# Altium project DAQ_v1.PrjPcb
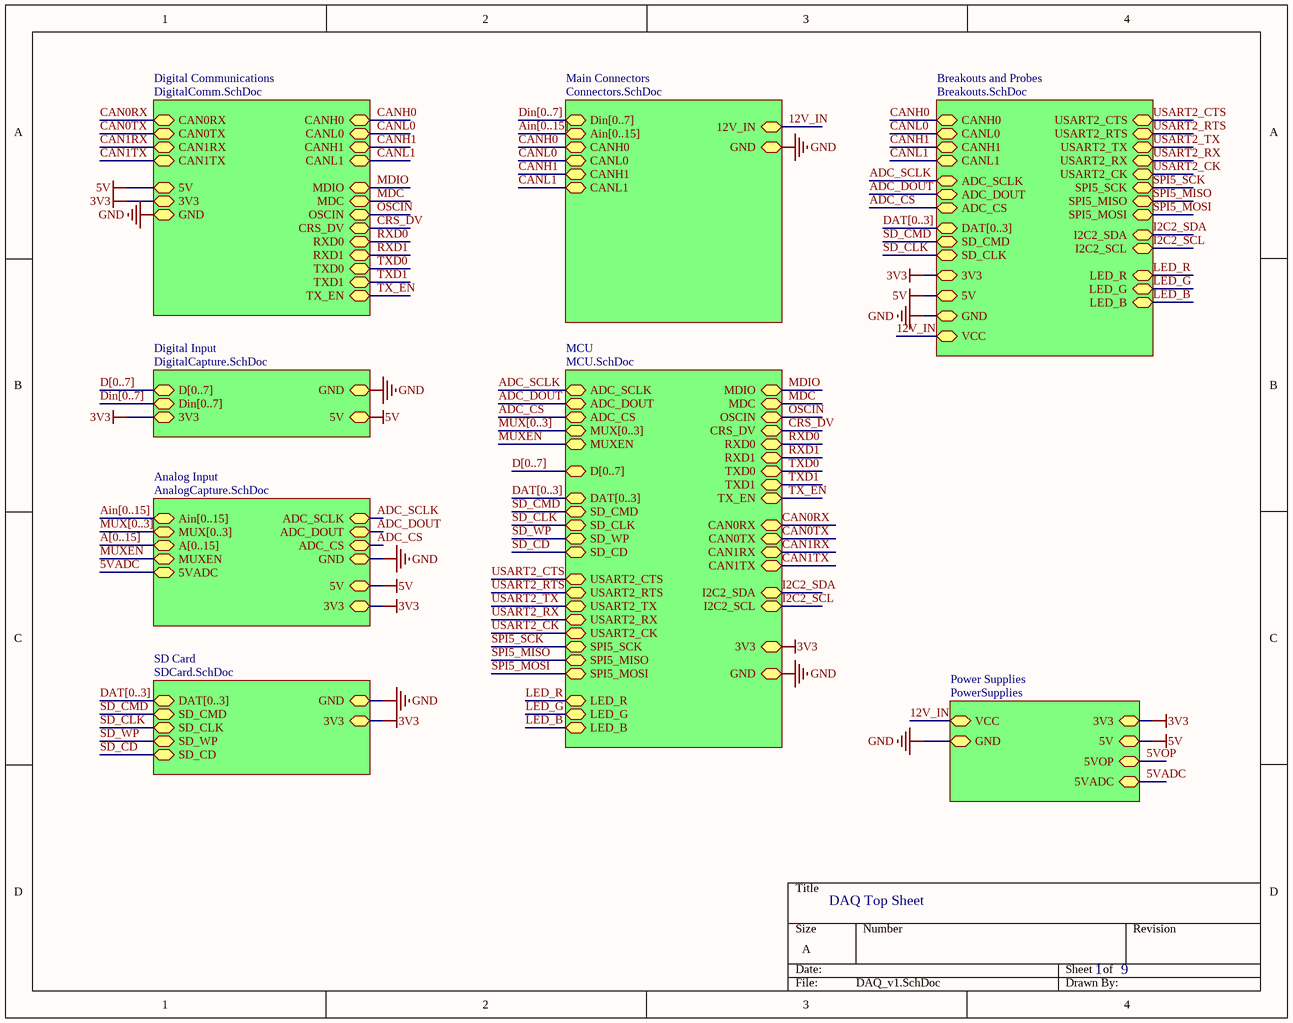
[diagram p0: DAQ_v1.SchDoc]
9 sheets, 174 parts. Net scope: hierarchical (ports join the sheet entries above them; power ports are global).
Board file: DAQ_v1.PcbDoc
Sheets:
  DAQ_v1.SchDoc
    Power Supplies = PowerSupplies.SchDoc
    Analog Input = AnalogCapture.SchDoc
    Digital Communications = DigitalComm.SchDoc
    Digital Input = DigitalCapture.SchDoc
    Main Connectors = Connectors.SchDoc
    MCU = MCU.SchDoc
    SD Card = SDCard.SchDoc
    Breakouts and Probes = Breakouts.SchDoc

## Sheet DAQ_v1.SchDoc: DAQ Top Sheet
size A; DocumentNumber: 1; SheetNumber: 1; SheetTotal: 9

### Sub-sheets
Analog Input = AnalogCapture.SchDoc: Ain[0..15], MUX[0..3], MUXEN, 5VADC, 5V, 3V3, ADC_SCLK, ADC_DOUT, ADC_CS, GND, A[0..15]
Breakouts and Probes = Breakouts.SchDoc: CANH0, CANL0, CANH1, CANL1, ADC_SCLK, ADC_DOUT, ADC_CS, DAT[0..3], SD_CMD, SD_CLK, USART2_CTS, USART2_RTS, USART2_TX, USART2_RX, USART2_CK, SPI5_SCK, SPI5_MISO, SPI5_MOSI, I2C2_SDA, I2C2_SCL, LED_R, LED_G, LED_B, 3V3, 5V, GND, VCC
Digital Communications = DigitalComm.SchDoc: 5V, 3V3, GND, CAN1TX, CAN1RX, CAN0TX, CAN0RX, CANH0, CANL0, CANH1, CANL1, MDIO, MDC, OSCIN, CRS_DV, RXD0, RXD1, TXD0, TXD1, TX_EN
Digital Input = DigitalCapture.SchDoc: D[0..7], Din[0..7], 3V3, GND, 5V
Main Connectors = Connectors.SchDoc: Din[0..7], Ain[0..15], CANH0, CANL0, CANH1, CANL1, 12V_IN, GND
MCU = MCU.SchDoc: MDIO, MDC, OSCIN, CRS_DV, RXD0, RXD1, TXD0, TXD1, TX_EN, ADC_SCLK, ADC_DOUT, ADC_CS, D[0..7], 3V3, GND, CAN1TX, CAN1RX, CAN0TX, CAN0RX, DAT[0..3], SD_CMD, SD_CLK, SD_WP, SD_CD, MUX[0..3], MUXEN, USART2_CTS, USART2_RTS, USART2_TX, USART2_RX, USART2_CK, SPI5_SCK, SPI5_MISO, SPI5_MOSI, I2C2_SDA, I2C2_SCL, LED_R, LED_G, LED_B
Power Supplies = PowerSupplies: 3V3, 5V, 5VOP, 5VADC, VCC, GND
SD Card = SDCard.SchDoc: 3V3, GND, DAT[0..3], SD_CMD, SD_CLK, SD_WP, SD_CD

### Nets
3V3: sheet Power Supplies/3V3, sheet Analog Input/3V3, sheet Digital Communications/3V3, sheet Digital Input/3V3, sheet MCU/3V3, sheet SD Card/3V3, sheet Breakouts and Probes/3V3
5V: sheet Power Supplies/5V, sheet Power Supplies/5VOP, sheet Analog Input/5V, sheet Digital Communications/5V, sheet Digital Input/5V, sheet Breakouts and Probes/5V  [also labelled 5VOP]
5VADC: sheet Power Supplies/5VADC, sheet Analog Input/5VADC
12V_IN: sheet Power Supplies/VCC, sheet Main Connectors/12V_IN, sheet Breakouts and Probes/VCC  [project net 12V]
GND: sheet Power Supplies/GND, sheet Analog Input/GND, sheet Digital Communications/GND, sheet Digital Input/GND, sheet Main Connectors/GND, sheet MCU/GND, sheet SD Card/GND, sheet Breakouts and Probes/GND
ADC_CS: sheet Analog Input/ADC_CS, sheet MCU/ADC_CS, sheet Breakouts and Probes/ADC_CS
ADC_DOUT: sheet Analog Input/ADC_DOUT, sheet MCU/ADC_DOUT, sheet Breakouts and Probes/ADC_DOUT
ADC_SCLK: sheet Analog Input/ADC_SCLK, sheet MCU/ADC_SCLK, sheet Breakouts and Probes/ADC_SCLK
CAN0RX: sheet Digital Communications/CAN0RX, sheet MCU/CAN0RX
CAN0TX: sheet Digital Communications/CAN0TX, sheet MCU/CAN0TX
CAN1RX: sheet Digital Communications/CAN1RX, sheet MCU/CAN1RX
CAN1TX: sheet Digital Communications/CAN1TX, sheet MCU/CAN1TX
CANH0: sheet Digital Communications/CANH0, sheet Main Connectors/CANH0, sheet Breakouts and Probes/CANH0
CANH1: sheet Digital Communications/CANH1, sheet Main Connectors/CANH1, sheet Breakouts and Probes/CANH1
CANL0: sheet Digital Communications/CANL0, sheet Main Connectors/CANL0, sheet Breakouts and Probes/CANL0
CANL1: sheet Digital Communications/CANL1, sheet Main Connectors/CANL1, sheet Breakouts and Probes/CANL1
CRS_DV: sheet Digital Communications/CRS_DV, sheet MCU/CRS_DV
I2C2_SCL: sheet MCU/I2C2_SCL, sheet Breakouts and Probes/I2C2_SCL
I2C2_SDA: sheet MCU/I2C2_SDA, sheet Breakouts and Probes/I2C2_SDA
LED_B: sheet MCU/LED_B, sheet Breakouts and Probes/LED_B
LED_G: sheet MCU/LED_G, sheet Breakouts and Probes/LED_G
LED_R: sheet MCU/LED_R, sheet Breakouts and Probes/LED_R
MDC: sheet Digital Communications/MDC, sheet MCU/MDC
MDIO: sheet Digital Communications/MDIO, sheet MCU/MDIO
MUXEN: sheet Analog Input/MUXEN, sheet MCU/MUXEN
OSCIN: sheet Digital Communications/OSCIN, sheet MCU/OSCIN
RXD0: sheet Digital Communications/RXD0, sheet MCU/RXD0
RXD1: sheet Digital Communications/RXD1, sheet MCU/RXD1
SD_CD: sheet MCU/SD_CD, sheet SD Card/SD_CD
SD_CLK: sheet MCU/SD_CLK, sheet SD Card/SD_CLK, sheet Breakouts and Probes/SD_CLK
SD_CMD: sheet MCU/SD_CMD, sheet SD Card/SD_CMD, sheet Breakouts and Probes/SD_CMD
SD_WP: sheet MCU/SD_WP, sheet SD Card/SD_WP
SPI5_MISO: sheet MCU/SPI5_MISO, sheet Breakouts and Probes/SPI5_MISO
SPI5_MOSI: sheet MCU/SPI5_MOSI, sheet Breakouts and Probes/SPI5_MOSI
SPI5_SCK: sheet MCU/SPI5_SCK, sheet Breakouts and Probes/SPI5_SCK
TX_EN: sheet Digital Communications/TX_EN, sheet MCU/TX_EN
TXD0: sheet Digital Communications/TXD0, sheet MCU/TXD0
TXD1: sheet Digital Communications/TXD1, sheet MCU/TXD1
USART2_CK: sheet MCU/USART2_CK, sheet Breakouts and Probes/USART2_CK
USART2_CTS: sheet MCU/USART2_CTS, sheet Breakouts and Probes/USART2_CTS
USART2_RTS: sheet MCU/USART2_RTS, sheet Breakouts and Probes/USART2_RTS
USART2_RX: sheet MCU/USART2_RX, sheet Breakouts and Probes/USART2_RX
USART2_TX: sheet MCU/USART2_TX, sheet Breakouts and Probes/USART2_TX

### Buses and harness runs
bus A[0..15] = sheet Analog Input/A[0..15]
bus Ain[0..15] = sheet Analog Input/Ain[0..15]
bus Ain[0..15] = sheet Main Connectors/Ain[0..15]
bus D[0..7] = sheet Digital Input/D[0..7]
bus D[0..7] = sheet MCU/D[0..7]
bus DAT[0..3] = sheet Breakouts and Probes/DAT[0..3]
bus DAT[0..3] = sheet MCU/DAT[0..3]
bus DAT[0..3] = sheet SD Card/DAT[0..3]
bus Din[0..7] = sheet Digital Input/Din[0..7]
bus Din[0..7] = sheet Main Connectors/Din[0..7]
bus MUX[0..3] = sheet Analog Input/MUX[0..3]
bus MUX[0..3] = sheet MCU/MUX[0..3]

## Sheet PowerSupplies.SchDoc: Power Supplies
size A; DocumentNumber: 2; SheetNumber: 2; SheetTotal: 9
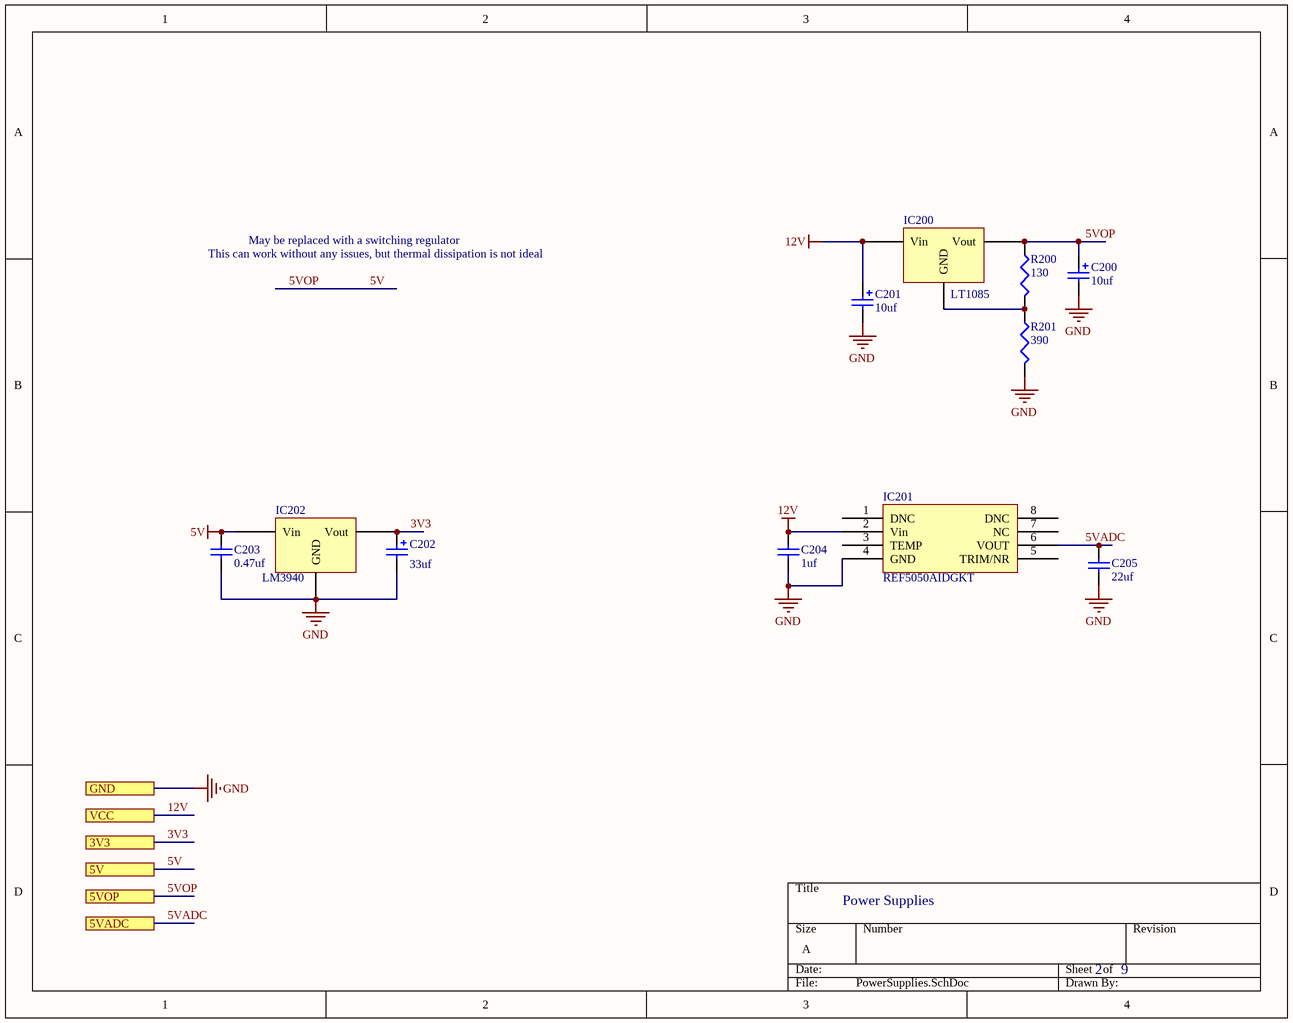
[diagram p1: PowerSupplies.SchDoc]

### Parts
C200  value 10uf  [SMD1206 Polarized]  (hidden comment: Cap)
C201  value 10uf  [SMD1206 Polarized]  (hidden comment: Cap)
C202  value 33uf  [SMD1206 Polarized]  (hidden comment: Cap)
C203  value 0.47uf  [SMD0603]  (hidden comment: Cap)
C204  value 1uf  [SMD0603]  (hidden comment: Capacitor Ceramic)
C205  value 22uf  [SMD1206]  (hidden comment: Capacitor Ceramic)
IC200  LT1085  [DPAK - 3pin]
IC201  REF5050AIDGKT  [VSSOP-8 (DGK)]
IC202  LM3940  [SOT-223]
R200  value 130  [SMD0603]  (hidden comment: Res)
R201  value 390  [SMD0603]  (hidden comment: Res)

### Ports
3V3, 5V, 5VADC, 5VOP, GND, VCC

### Nets
3V3: C202.1 IC202.Vout ; port 3V3
5V: C200.1 C203.2 IC200.Vout IC202.Vin R200.1 ; port 5V, port 5VOP  [also labelled 5VOP]
5VADC: C205.2 IC201.6(VOUT) ; port 5VADC
12V: C201.1 C204.2 IC200.Vin IC201.2(Vin) ; port VCC
GND: C200.2 C201.2 C202.2 C203.1 C204.1 C205.1 IC201.4(GND) IC202.GND R201.2 ; port GND
NetIC200_GND: IC200.GND R200.2 R201.1

Not connected (* = marked no-connect by the designer): IC201 1(DNC) 3(TEMP) 5(TRIM/NR) 7(NC) 8(DNC)

### Notes on the sheet
- This can work without any issues, but thermal dissipation is not ideal
- May be replaced with a switching regulator

### Library data of the parts
C200-C202 = Capacitor Polarized: Polarized Capacitor (Surface Mount)
C203-C205 = Capacitor Ceramic: Ceramic Chip Capacitor
IC200 = LT1085: 3A DC/DC Converter (SM); pin to pad: GND>1 Vin>3 Vout>2
IC201 = REF5050AIDGKT: 5V Precision Reference Voltage
IC202 = LM3940: 3.3V 1A LDO; pin to pad: GND>2 Vin>1 Vout>3
R200 R201 = Resistor

## Sheet AnalogCapture.SchDoc: Analog Capture
size A; DocumentNumber: 3; SheetNumber: 3; SheetTotal: 9
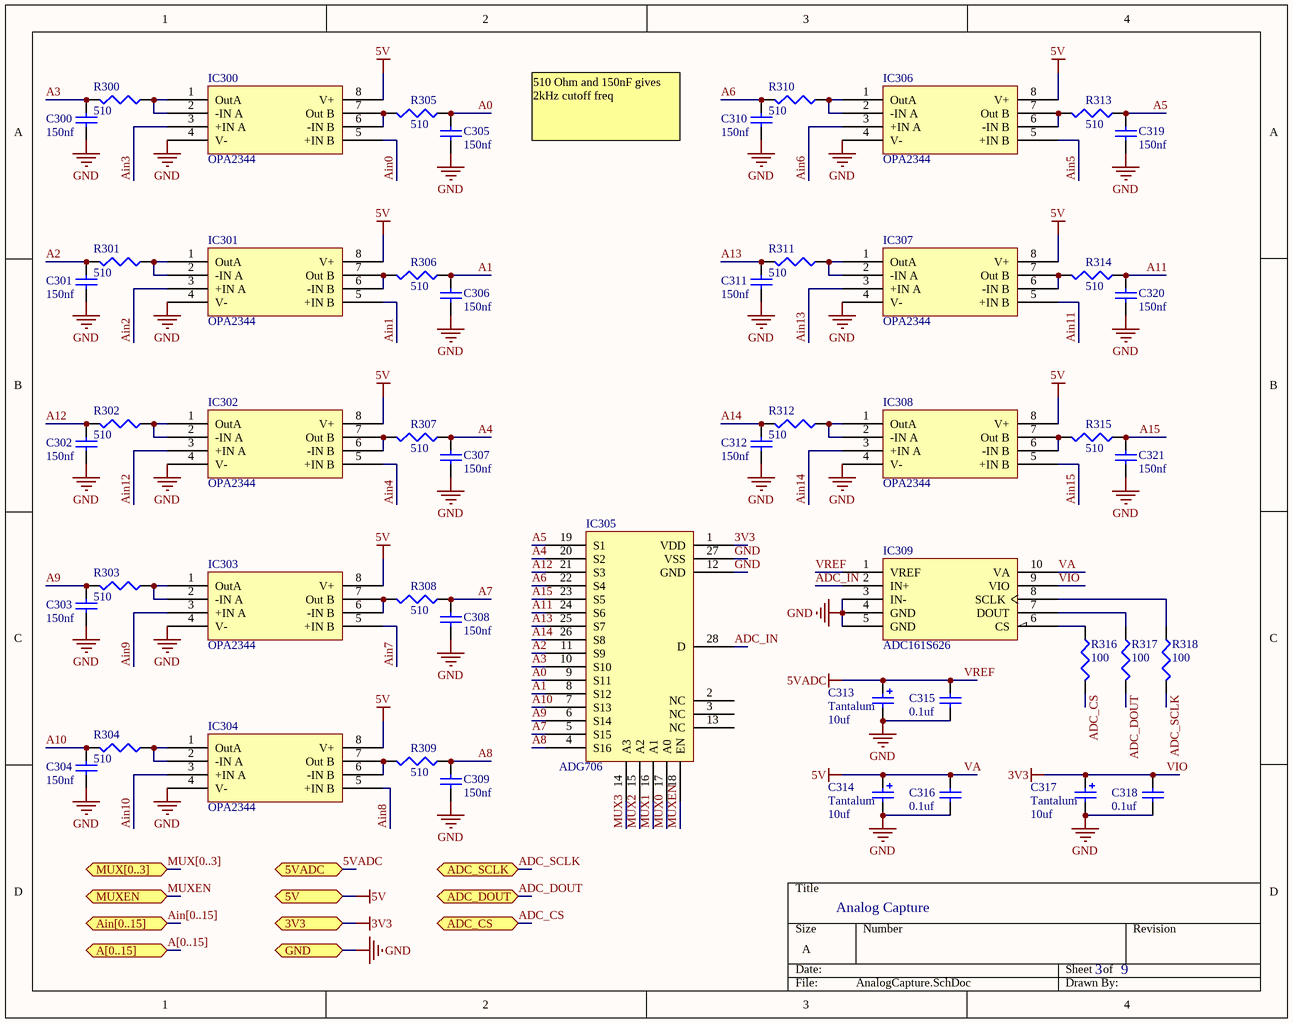
[diagram p2: AnalogCapture.SchDoc]

### Parts
C300  value 150nf  [SMD0603]  (hidden comment: Cap)
C301  value 150nf  [SMD0603]  (hidden comment: Cap)
C302  value 150nf  [SMD0603]  (hidden comment: Cap)
C303  value 150nf  [SMD0603]  (hidden comment: Cap)
C304  value 150nf  [SMD0603]  (hidden comment: Cap)
C305  value 150nf  [SMD0603]  (hidden comment: Cap)
C306  value 150nf  [SMD0603]  (hidden comment: Cap)
C307  value 150nf  [SMD0603]  (hidden comment: Cap)
C308  value 150nf  [SMD0603]  (hidden comment: Cap)
C309  value 150nf  [SMD0603]  (hidden comment: Cap)
C310  value 150nf  [SMD0603]  (hidden comment: Cap)
C311  value 150nf  [SMD0603]  (hidden comment: Cap)
C312  value 150nf  [SMD0603]  (hidden comment: Cap)
C313  Tantalum  value 10uf  [SMD1206 Polarized]
C314  Tantalum  value 10uf  [SMD1206 Polarized]
C315  value 0.1uf  [SMD0603]  (hidden comment: Capacitor Ceramic)
C316  value 0.1uf  [SMD0603]  (hidden comment: Capacitor Ceramic)
C317  Tantalum  value 10uf  [SMD1206 Polarized]
C318  value 0.1uf  [SMD0603]  (hidden comment: Capacitor Ceramic)
C319  value 150nf  [SMD0603]  (hidden comment: Cap)
C320  value 150nf  [SMD0603]  (hidden comment: Cap)
C321  value 150nf  [SMD0603]  (hidden comment: Cap)
IC300  OPA2344  [SOIC-8]
IC301  OPA2344  [SOIC-8]
IC302  OPA2344  [SOIC-8]
IC303  OPA2344  [SOIC-8]
IC304  OPA2344  [SOIC-8]
IC305  ADG706  [TSSOP-28]
IC306  OPA2344  [SOIC-8]
IC307  OPA2344  [SOIC-8]
IC308  OPA2344  [SOIC-8]
IC309  ADC161S626  [VSSOP-10 (DGS)]
R300  value 510  [SMD0603]  (hidden comment: Res)
R301  value 510  [SMD0603]  (hidden comment: Res)
R302  value 510  [SMD0603]  (hidden comment: Res)
R303  value 510  [SMD0603]  (hidden comment: Res)
R304  value 510  [SMD0603]  (hidden comment: Res)
R305  value 510  [SMD0603]  (hidden comment: Res)
R306  value 510  [SMD0603]  (hidden comment: Res)
R307  value 510  [SMD0603]  (hidden comment: Res)
R308  value 510  [SMD0603]  (hidden comment: Res)
R309  value 510  [SMD0603]  (hidden comment: Res)
R310  value 510  [SMD0603]  (hidden comment: Res)
R311  value 510  [SMD0603]  (hidden comment: Res)
R312  value 510  [SMD0603]  (hidden comment: Res)
R313  value 510  [SMD0603]  (hidden comment: Res)
R314  value 510  [SMD0603]  (hidden comment: Res)
R315  value 510  [SMD0603]  (hidden comment: Res)
R316  value 100  [SMD0603]  (hidden comment: Res)
R317  value 100  [SMD0603]  (hidden comment: Res)
R318  value 100  [SMD0603]  (hidden comment: Res)

### Ports
3V3, 5V, 5VADC, A[0..15], ADC_CS, ADC_DOUT, ADC_SCLK, Ain[0..15], GND, MUX[0..3], MUXEN

### Nets
3V3: C317.1 C318.2 IC305.1(VDD) IC309.9(VIO) ; port 3V3  [also labelled VIO]
5V: C314.1 C316.2 IC300.8(V+) IC301.8(V+) IC302.8(V+) IC303.8(V+) IC304.8(V+) IC306.8(V+) IC307.8(V+) IC308.8(V+) IC309.10(VA) ; port 5V  [also labelled VA]
5VADC: C313.1 C315.2 IC309.1(VREF) ; port 5VADC  [also labelled VREF]
GND: C300.2 C301.2 C302.2 C303.2 C304.2 C305.1 C306.1 C307.1 C308.1 C309.1 C310.2 C311.2 C312.2 C313.2 C314.2 C315.1 C316.1 C317.2 C318.1 C319.1 C320.1 C321.1 IC300.4(V-) IC301.4(V-) IC302.4(V-) IC303.4(V-) IC304.4(V-) IC305.12(GND) IC305.27(VSS) IC306.4(V-) IC307.4(V-) IC308.4(V-) IC309.3(IN-) IC309.4(GND) IC309.5(GND) ; port GND
A0: C305.2 IC305.9(S11) R305.1
A1: C306.2 IC305.8(S12) R306.1
A2: C301.1 IC305.11(S9) R301.2
A3: C300.1 IC305.10(S10) R300.2
A4: C307.2 IC305.20(S2) R307.1
A5: C319.2 IC305.19(S1) R313.1
A6: C310.1 IC305.22(S4) R310.2
A7: C308.2 IC305.5(S15) R308.1
A8: C309.2 IC305.4(S16) R309.1
A9: C303.1 IC305.6(S14) R303.2
A10: C304.1 IC305.7(S13) R304.2
A11: C320.2 IC305.24(S6) R314.1
A12: C302.1 IC305.21(S3) R302.2
A13: C311.1 IC305.25(S7) R311.2
A14: C312.1 IC305.26(S8) R312.2
A15: C321.2 IC305.23(S5) R315.1
ADC_CS: R316.2 ; port ADC_CS
ADC_DOUT: R317.2 ; port ADC_DOUT
ADC_IN: IC305.28(D) IC309.2(IN+)
ADC_SCLK: R318.2 ; port ADC_SCLK
Ain0: IC300.5(+IN_B)
Ain1: IC301.5(+IN_B)
Ain2: IC301.3(+IN_A)
Ain3: IC300.3(+IN_A)
Ain4: IC302.5(+IN_B)
Ain5: IC306.5(+IN_B)
Ain6: IC306.3(+IN_A)
Ain7: IC303.5(+IN_B)
Ain8: IC304.5(+IN_B)
Ain9: IC303.3(+IN_A)
Ain10: IC304.3(+IN_A)
Ain11: IC307.5(+IN_B)
Ain12: IC302.3(+IN_A)
Ain13: IC307.3(+IN_A)
Ain14: IC308.3(+IN_A)
Ain15: IC308.5(+IN_B)
MUX0: IC305.17(A0)
MUX1: IC305.16(A1)
MUX2: IC305.15(A2)
MUX3: IC305.14(A3)
MUXEN: IC305.18(EN) ; port MUXEN
NetIC300_1: IC300.1(OutA) IC300.2(-IN_A) R300.1
NetIC300_6: IC300.6(-IN_B) IC300.7(Out_B) R305.2
NetIC301_1: IC301.1(OutA) IC301.2(-IN_A) R301.1
NetIC301_6: IC301.6(-IN_B) IC301.7(Out_B) R306.2
NetIC302_1: IC302.1(OutA) IC302.2(-IN_A) R302.1
NetIC302_6: IC302.6(-IN_B) IC302.7(Out_B) R307.2
NetIC303_1: IC303.1(OutA) IC303.2(-IN_A) R303.1
NetIC303_6: IC303.6(-IN_B) IC303.7(Out_B) R308.2
NetIC304_1: IC304.1(OutA) IC304.2(-IN_A) R304.1
NetIC304_6: IC304.6(-IN_B) IC304.7(Out_B) R309.2
NetIC306_1: IC306.1(OutA) IC306.2(-IN_A) R310.1
NetIC306_6: IC306.6(-IN_B) IC306.7(Out_B) R313.2
NetIC307_1: IC307.1(OutA) IC307.2(-IN_A) R311.1
NetIC307_6: IC307.6(-IN_B) IC307.7(Out_B) R314.2
NetIC308_1: IC308.1(OutA) IC308.2(-IN_A) R312.1
NetIC308_6: IC308.6(-IN_B) IC308.7(Out_B) R315.2
NetIC309_6: IC309.6(CS) R316.1
NetIC309_7: IC309.7(DOUT) R317.1
NetIC309_8: IC309.8(SCLK) R318.1

Not connected (* = marked no-connect by the designer): IC305 2(NC) 3(NC) 13(NC)

### Buses and harness runs
bus A[0..15] = port A[0..15]
bus Ain[0..15] = port Ain[0..15]
bus MUX[0..3] = port MUX[0..3]

### Notes on the sheet
- 510 Ohm and 150nF gives 2kHz cutoff freq

### Library data of the parts
C300-C312 C315 C316 C318-C321 = Capacitor Ceramic: Ceramic Chip Capacitor
C313 C314 C317 = Capacitor Polarized: Polarized Capacitor (Surface Mount)
IC300-IC304 IC306-IC308 = OPA2344: Rail to rail opamp
IC305 = ADG706: 16:1 Mux
IC309 = ADC161S626: TI ADC; 250ksps
R300-R318 = Resistor

## Sheet DigitalComm.SchDoc: Digital Communications
size A; DocumentNumber: 4; SheetNumber: 4; SheetTotal: 9
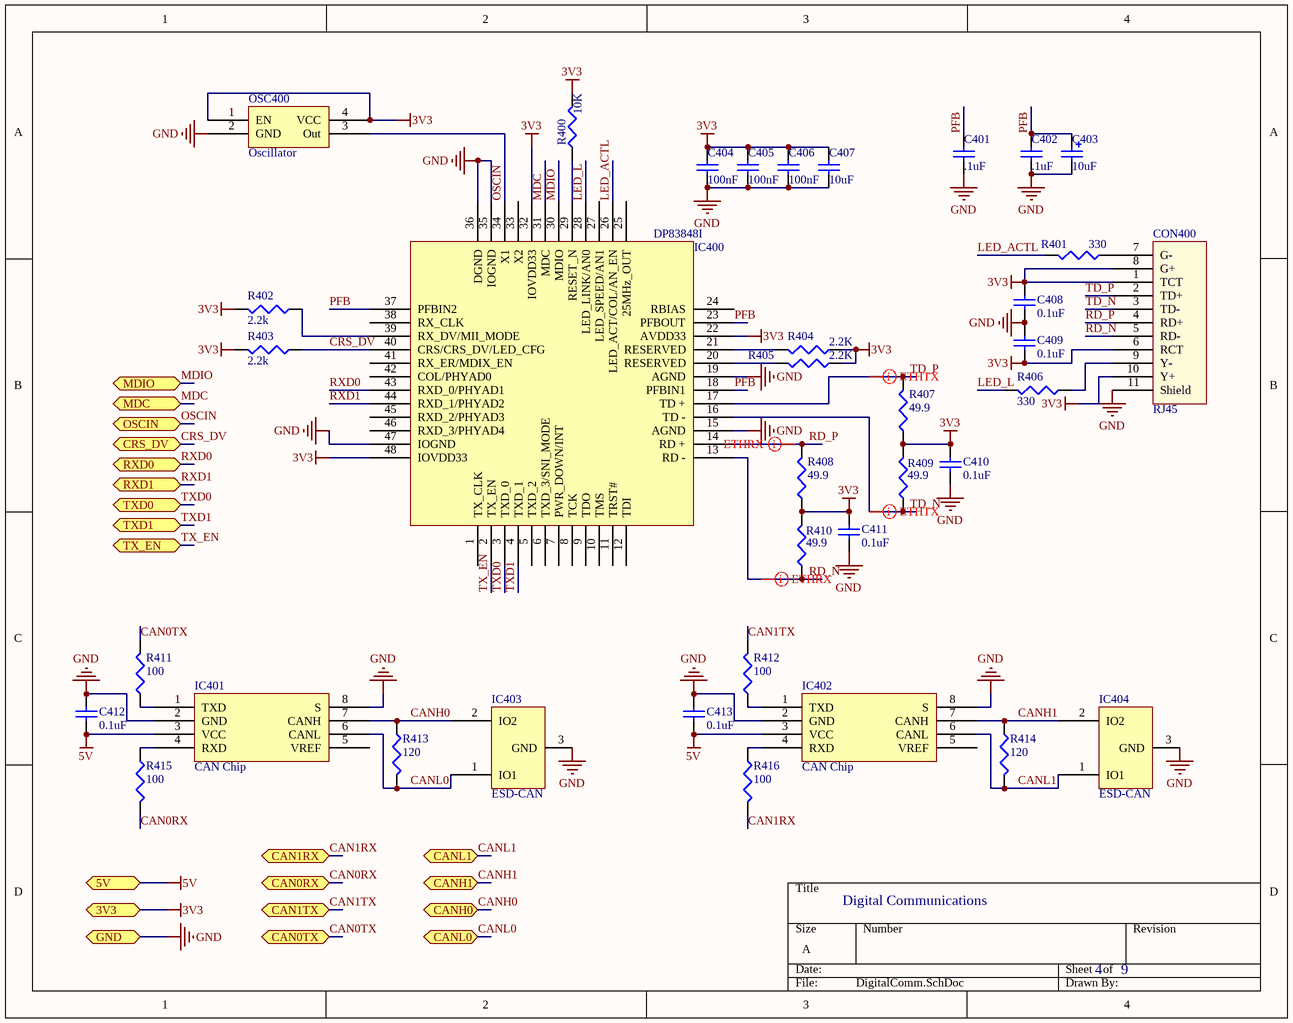
[diagram p3: DigitalComm.SchDoc]

### Parts
C401  value .1uF  [SMD0603]  (hidden comment: Capacitor Ceramic)
C402  value .1uF  [SMD0603]  (hidden comment: Capacitor Ceramic)
C403  value 10uF  [SMD1206 Polarized]  (hidden comment: Cap)
C404  value 100nF  [SMD0603]  (hidden comment: Capacitor Ceramic)
C405  value 100nF  [SMD0603]  (hidden comment: Capacitor Ceramic)
C406  value 100nF  [SMD0603]  (hidden comment: Capacitor Ceramic)
C407  value 10uF  [SMD0805]  (hidden comment: Capacitor Ceramic)
C408  value 0.1uF  [SMD0603]  (hidden comment: Cap)
C409  value 0.1uF  [SMD0603]  (hidden comment: Cap)
C410  value 0.1uF  [SMD0603]  (hidden comment: Cap)
C411  value 0.1uF  [SMD0603]  (hidden comment: Cap)
C412  value 0.1uF  [SMD0603]  (hidden comment: Capacitor Ceramic)
C413  value 0.1uF  [SMD0603]  (hidden comment: Capacitor Ceramic)
CON400  RJ45  [RJ45]
IC400  DP83848I  [LQFP-48]
IC401  CAN Chip  [SOIC-8]
IC402  CAN Chip  [SOIC-8]
IC403  ESD-CAN  [SOT-23-3]
IC404  ESD-CAN  [SOT-23-3]
OSC400  Oscillator  [SM77H-OSC]
R400  value 10K  [SMD0603]  (hidden comment: Res)
R401  value 330  [SMD0603]  (hidden comment: Res)
R402  value 2.2k  [SMD0603]  (hidden comment: Res)
R403  value 2.2k  [SMD0603]  (hidden comment: Res)
R404  value 2.2K  [SMD0603]  (hidden comment: Res)
R405  value 2.2K  [SMD0603]  (hidden comment: Res)
R406  value 330  [SMD0603]  (hidden comment: Res)
R407  value 49.9  [SMD0603]  (hidden comment: Res)
R408  value 49.9  [SMD0603]  (hidden comment: Res)
R409  value 49.9  [SMD0603]  (hidden comment: Res)
R410  value 49.9  [SMD0603]  (hidden comment: Res)
R411  value 100  [SMD0603]  (hidden comment: Res)
R412  value 100  [SMD0603]  (hidden comment: Res)
R413  value 120  [SMD0603]  (hidden comment: Res)
R414  value 120  [SMD0603]  (hidden comment: Res)
R415  value 100  [SMD0603]  (hidden comment: Res)
R416  value 100  [SMD0603]  (hidden comment: Res)

### Ports
3V3, 5V, CAN0RX, CAN0TX, CAN1RX, CAN1TX, CANH0, CANH1, CANL0, CANL1, CRS_DV, GND, MDC, MDIO, OSCIN, RXD0, RXD1, TX_EN, TXD0, TXD1

### Nets
3V3: C404.2 C405.2 C406.2 C407.2 C408.2 C409.1 C410.2 C411.2 CON400.1(TCT) CON400.6(RCT) CON400.8(G+) CON400.10(Y+) IC400.22(AVDD33) IC400.32(IOVDD33) IC400.48(IOVDD33) OSC400.1(EN) OSC400.4(VCC) R400.2 R402.2 R403.2 R404.1 R405.1 R407.1 R408.1 R409.2 R410.2 ; port 3V3
5V: C412.1 C413.1 IC401.3(VCC) IC402.3(VCC) ; port 5V
GND: C401.1 C402.1 C403.2 C404.1 C405.1 C406.1 C407.1 C408.1 C409.2 C410.1 C411.1 C412.2 C413.2 CON400.11(Shield) IC400.15(AGND) IC400.19(AGND) IC400.35(IOGND) IC400.36(DGND) IC400.47(IOGND) IC401.2(GND) IC401.8(S) IC402.2(GND) IC402.8(S) IC403.3(GND) IC404.3(GND) OSC400.2(GND) ; port GND
CAN0RX: R415.2 ; port CAN0RX
CAN0TX: R411.2 ; port CAN0TX
CAN1RX: R416.2 ; port CAN1RX
CAN1TX: R412.2 ; port CAN1TX
CANH0: IC401.7(CANH) IC403.2(IO2) R413.1 ; port CANH0
CANH1: IC402.7(CANH) IC404.2(IO2) R414.1 ; port CANH1
CANL0: IC401.6(CANL) IC403.1(IO1) R413.2 ; port CANL0
CANL1: IC402.6(CANL) IC404.1(IO1) R414.2 ; port CANL1
CRS_DV: IC400.40(CRS/CRS_DV/LED_CFG) R403.1 ; port CRS_DV
LED_ACTL: IC400.26(LED_ACT/COL/AN_EN) R401.2
LED_L: IC400.28(LED_LINK/AN0) R406.2
MDC: IC400.31(MDC) ; port MDC
MDIO: IC400.30(MDIO) ; port MDIO
OSCIN: IC400.34(X1) OSC400.3(Out) ; port OSCIN
PFB: C401.2 C402.2 C403.1 IC400.18(PFBIN1) IC400.23(PFBOUT) IC400.37(PFBIN2)
RD_N: CON400.5(RD-) IC400.13(RD_-) R410.1
RD_P: CON400.4(RD+) IC400.14(RD_+) R408.2
RXD0: IC400.43(RXD_0/PHYAD1) ; port RXD0
RXD1: IC400.44(RXD_1/PHYAD2) ; port RXD1
TD_N: CON400.3(TD-) IC400.16(TD_-) R409.1
TD_P: CON400.2(TD+) IC400.17(TD_+) R407.2
TX_EN: IC400.2(TX_EN) ; port TX_EN
TXD0: IC400.3(TXD_0) ; port TXD0
TXD1: IC400.4(TXD_1) ; port TXD1
NetCON400_7: CON400.7(G-) R401.1
NetCON400_9: CON400.9(Y-) R406.1
NetIC400_20: IC400.20(RESERVED) R405.2
NetIC400_21: IC400.21(RESERVED) R404.2
NetIC400_29: IC400.29(RESET_N) R400.1
NetIC400_39: IC400.39(RX_DV/MII_MODE) R402.1
NetIC401_1: IC401.1(TXD) R411.1
NetIC401_4: IC401.4(RXD) R415.1
NetIC402_1: IC402.1(TXD) R412.1
NetIC402_4: IC402.4(RXD) R416.1

Not connected (* = marked no-connect by the designer): IC400 1(TX_CLK) 5(TXD_2) 6(TXD_3/SNI_MODE) 7(PWR_DOWN/INT) 8(TCK) 9(TDO) 10(TMS) 11(TRST#) 12(TDI) 24(RBIAS) 25(25MHz_OUT) 27(LED_SPEED/AN1) 33(X2) 38(RX_CLK) 41(RX_ER/MDIX_EN) 42(COL/PHYAD0) 45(RXD_2/PHYAD3) 46(RXD_3/PHYAD4); IC401 5(VREF); IC402 5(VREF)

### Layout directives
differential pair: RD_N, RD_P, TD_N, TD_P

### Library data of the parts
C401 C402 C404-C413 = Capacitor Ceramic: Ceramic Chip Capacitor
C403 = Capacitor Polarized: Polarized Capacitor (Surface Mount)
CON400 = RJ45: RJ45 Ethernet Connector with built in magnetics; pin to pad: 11>S
IC400 = DP83848I: Ethernet PHY IC; compatitble with DP83848C
IC401 IC402 = SN65HVD1050
IC403 IC404 = ESDCAN24-2BLY
OSC400 = SM7745HEV: 50Mhz Oscillator
R400-R416 = Resistor

## Sheet DigitalCapture.SchDoc: Digital Capture
size A; DocumentNumber: 5; SheetNumber: 5; SheetTotal: 9
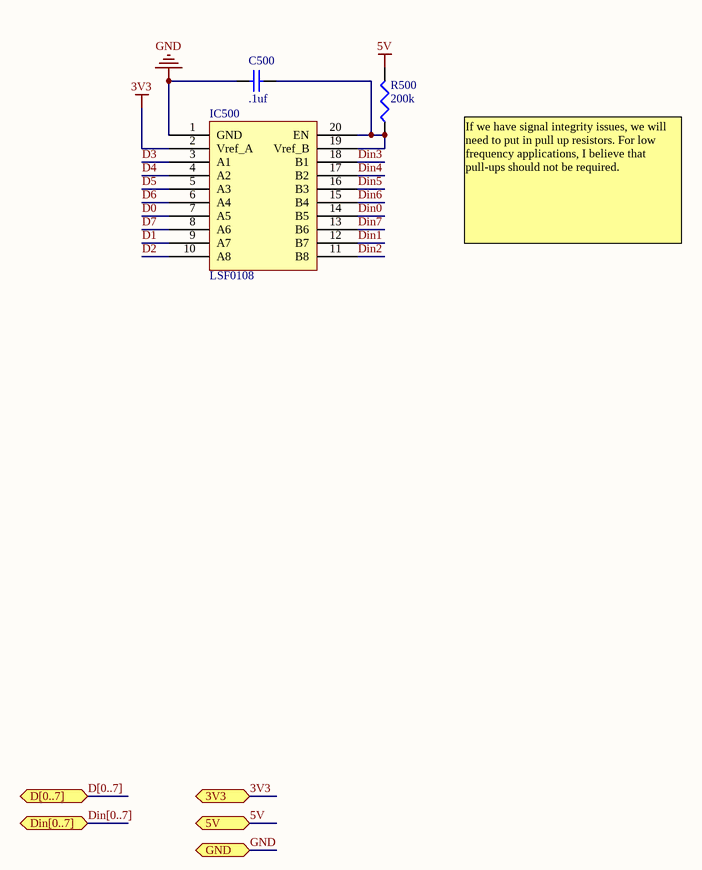
[diagram p4: DigitalCapture.SchDoc]

### Parts
C500  value .1uf  [SMD0603]  (hidden comment: Cap)
IC500  LSF0108  [TSSOP-20]
R500  value 200k  [SMD0603]  (hidden comment: Res)

### Ports
3V3, 5V, D[0..7], Din[0..7], GND

### Nets
3V3: IC500.2(Vref_A) ; port 3V3
5V: R500.2 ; port 5V
GND: C500.2 IC500.1(GND) ; port GND
D0: IC500.7(A5)
D1: IC500.9(A7)
D2: IC500.10(A8)
D3: IC500.3(A1)
D4: IC500.4(A2)
D5: IC500.5(A3)
D6: IC500.6(A4)
D7: IC500.8(A6)
Din0: IC500.14(B5)
Din1: IC500.12(B7)
Din2: IC500.11(B8)
Din3: IC500.18(B1)
Din4: IC500.17(B2)
Din5: IC500.16(B3)
Din6: IC500.15(B4)
Din7: IC500.13(B6)
NetC500_1: C500.1 IC500.19(Vref_B) IC500.20(EN) R500.1

### Buses and harness runs
bus D[0..7] = port D[0..7]
bus Din[0..7] = port Din[0..7]

### Notes on the sheet
- If we have signal integrity issues, we will need to put in pull up resistors. For low frequency applications, I believe that pull-ups should not be required.

### Library data of the parts
C500 = Capacitor Ceramic: Ceramic Chip Capacitor
IC500 = LSF0108: 8 bit 5V to 3.3V level shifter
R500 = Resistor

## Sheet Connectors.SchDoc: Connectors and IO
size A; DocumentNumber: 6; SheetNumber: 6; SheetTotal: 9
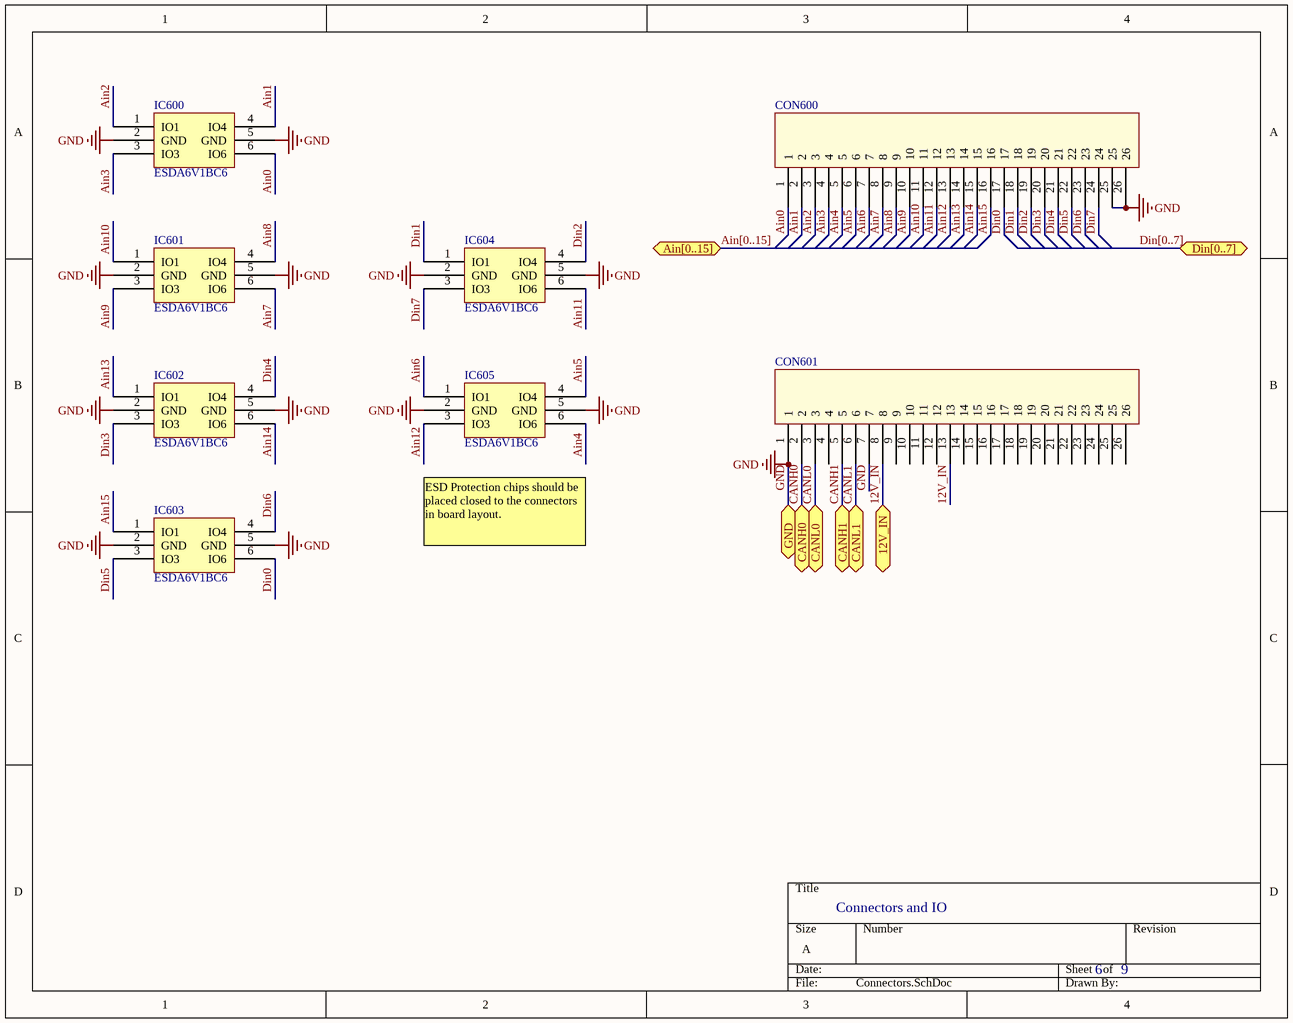
[diagram p5: Connectors.SchDoc]

### Parts
CON600  26 Pin Conn  [AMP SuperSeal 1.0 26pin]  (value not drawn)
CON601  26 Pin Conn  [AMP SuperSeal 1.0 26pin]  (value not drawn)
IC600  ESDA6V1BC6  [SOT23-6L]
IC601  ESDA6V1BC6  [SOT23-6L]
IC602  ESDA6V1BC6  [SOT23-6L]
IC603  ESDA6V1BC6  [SOT23-6L]
IC604  ESDA6V1BC6  [SOT23-6L]
IC605  ESDA6V1BC6  [SOT23-6L]

### Ports
12V_IN, Ain[0..15], CANH0, CANH1, CANL0, CANL1, Din[0..7], GND

### Nets
12V_IN: CON601.8 CON601.13 ; port 12V_IN  [project net 12V]
GND: CON600.25 CON600.26 CON601.1 CON601.7 IC600.2(GND) IC600.5(GND) IC601.2(GND) IC601.5(GND) IC602.2(GND) IC602.5(GND) IC603.2(GND) IC603.5(GND) IC604.2(GND) IC604.5(GND) IC605.2(GND) IC605.5(GND) ; port GND
Ain0: CON600.1 IC600.6(IO6)
Ain1: CON600.2 IC600.4(IO4)
Ain2: CON600.3 IC600.1(IO1)
Ain3: CON600.4 IC600.3(IO3)
Ain4: CON600.5 IC605.6(IO6)
Ain5: CON600.6 IC605.4(IO4)
Ain6: CON600.7 IC605.1(IO1)
Ain7: CON600.8 IC601.6(IO6)
Ain8: CON600.9 IC601.4(IO4)
Ain9: CON600.10 IC601.3(IO3)
Ain10: CON600.11 IC601.1(IO1)
Ain11: CON600.12 IC604.6(IO6)
Ain12: CON600.13 IC605.3(IO3)
Ain13: CON600.14 IC602.1(IO1)
Ain14: CON600.15 IC602.6(IO6)
Ain15: CON600.16 IC603.1(IO1)
CANH0: CON601.2 ; port CANH0
CANH1: CON601.5 ; port CANH1
CANL0: CON601.3 ; port CANL0
CANL1: CON601.6 ; port CANL1
Din0: CON600.17 IC603.6(IO6)
Din1: CON600.18 IC604.1(IO1)
Din2: CON600.19 IC604.4(IO4)
Din3: CON600.20 IC602.3(IO3)
Din4: CON600.21 IC602.4(IO4)
Din5: CON600.22 IC603.3(IO3)
Din6: CON600.23 IC603.4(IO4)
Din7: CON600.24 IC604.3(IO3)

Not connected (* = marked no-connect by the designer): CON601 4 9 10 11 12 14 15 16 17 18 19 20 21 22 23 24 25 26

### Buses and harness runs
bus Ain[0..15] = port Ain[0..15]
bus Din[0..7] = port Din[0..7]

### Notes on the sheet
- ESD Protection chips should be placed closed to the connectors in board layout.

### Library data of the parts
CON600 CON601 = AMP_26Pin: AMP SuperSeal 1.0 26 Pin
IC600-IC605 = ESDA6V1BC6: 4 channel bi directional ESD protection

## Sheet MCU.SchDoc: MCU
size A; DocumentNumber: 9; SheetNumber: 9; SheetTotal: 9
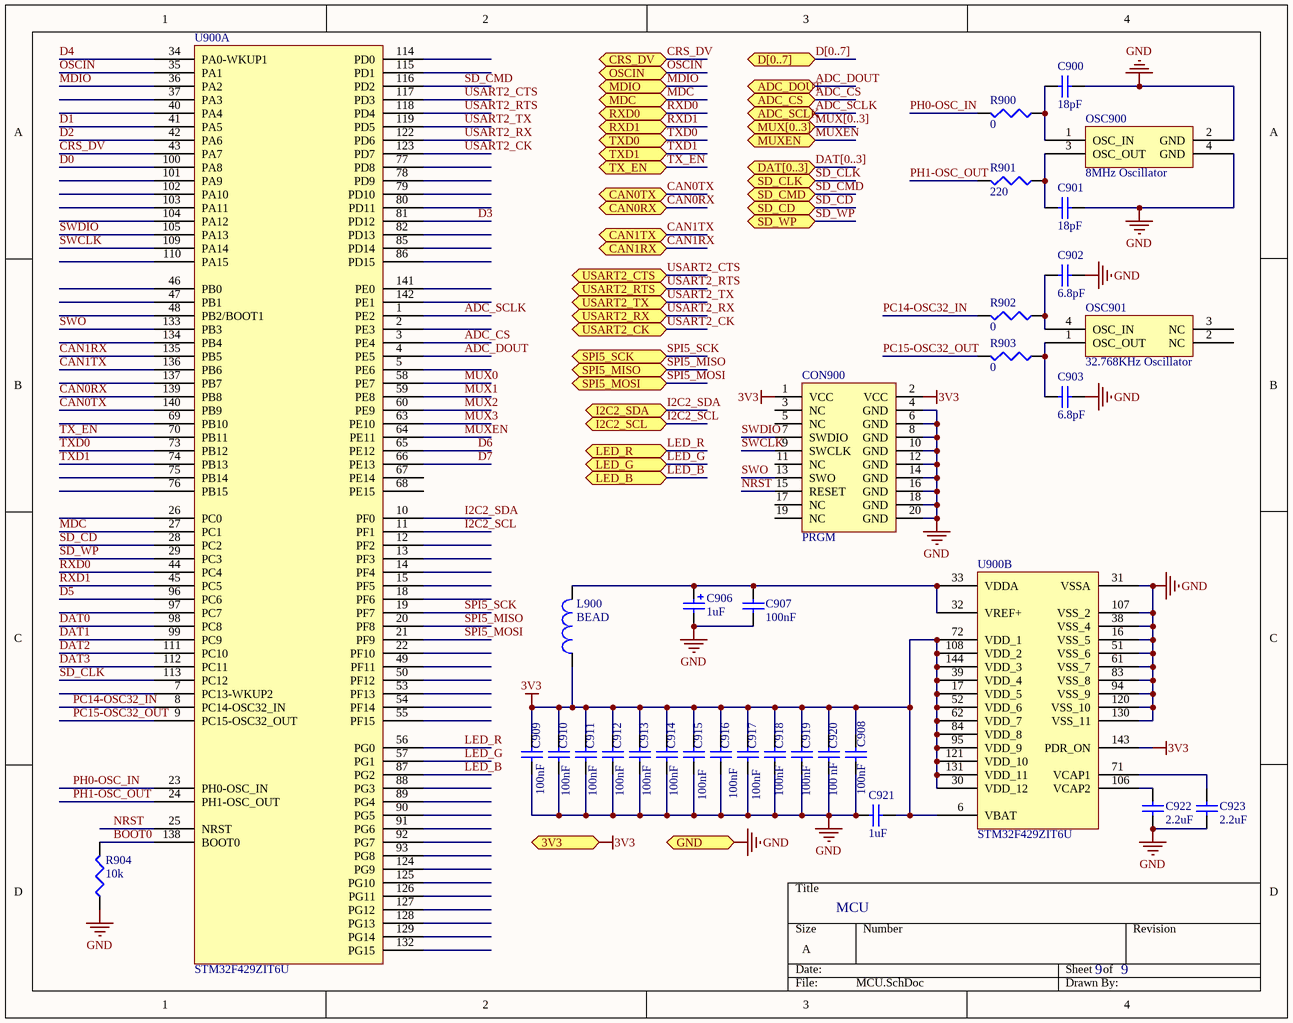
[diagram p6: MCU.SchDoc]

### Parts
C900  value 18pF  [SMD0603]  (hidden comment: Cap)
C901  value 18pF  [SMD0603]  (hidden comment: Cap)
C902  value 6.8pF  [SMD0603]  (hidden comment: Cap)
C903  value 6.8pF  [SMD0603]  (hidden comment: Cap)
C906  value 1uF  [SMD1206 Polarized]  (hidden comment: Cap)
C907  value 100nF  [SMD0603]  (hidden comment: Cap)
C908  value 100nF  [SMD0603]  (hidden comment: Cap)
C909  value 100nF  [SMD0603]  (hidden comment: Cap)
C910  value 100nF  [SMD0603]  (hidden comment: Cap)
C911  value 100nF  [SMD0603]  (hidden comment: Cap)
C912  value 100nF  [SMD0603]  (hidden comment: Cap)
C913  value 100nF  [SMD0603]  (hidden comment: Cap)
C914  value 100nF  [SMD0603]  (hidden comment: Cap)
C915  value 100nF  [SMD0603]  (hidden comment: Cap)
C916  value 100nF  [SMD0603]  (hidden comment: Cap)
C917  value 100nF  [SMD0603]  (hidden comment: Cap)
C918  value 100nF  [SMD0603]  (hidden comment: Cap)
C919  value 100nF  [SMD0603]  (hidden comment: Cap)
C920  value 100 nF  [SMD0603]  (hidden comment: Cap)
C921  value 1uF  [SMD0805]  (hidden comment: Cap)
C922  value 2.2uF  [SMD1206]  (hidden comment: Cap)
C923  value 2.2uF  [SMD1206]  (hidden comment: Cap)
CON900  PRGM  [JTAG/SWO-20PIN]
L900  BEAD  [SMD0603]
OSC900  8MHz Oscillator  [ABMM2-OSC]
OSC901  32.768KHz Oscillator  [MC-306-OSC]
R900  value 0  [SMD0603]  (hidden comment: Res)
R901  value 220  [SMD0603]  (hidden comment: Res)
R902  value 0  [SMD0603]  (hidden comment: Res)
R903  value 0  [SMD0603]  (hidden comment: Res)
R904  value 10k  [SMD0603]  (hidden comment: Res)
U900  STM32F429ZIT6U  [LQPF144]  (parts A,B of 2)

### Ports
3V3, ADC_CS, ADC_DOUT, ADC_SCLK, CAN0RX, CAN0TX, CAN1RX, CAN1TX, CRS_DV, D[0..7], DAT[0..3], GND, I2C2_SCL, I2C2_SDA, LED_B, LED_G, LED_R, MDC, MDIO, MUX[0..3], MUXEN, OSCIN, RXD0, RXD1, SD_CD, SD_CLK, SD_CMD, SD_WP, SPI5_MISO, SPI5_MOSI, SPI5_SCK, TX_EN, TXD0, TXD1, USART2_CK, USART2_CTS, USART2_RTS, USART2_RX, USART2_TX

### Nets
3V3: C908.1 C909.2 C910.2 C911.2 C912.2 C913.2 C914.2 C915.2 C916.2 C917.2 C918.2 C919.2 C920.2 C921.1 CON900.1(VCC) CON900.2(VCC) L900.1 U900.6(VBAT) U900.17(VDD_5) U900.30(VDD_12) U900.39(VDD_4) U900.52(VDD_6) U900.62(VDD_7) U900.72(VDD_1) U900.84(VDD_8) U900.95(VDD_9) U900.108(VDD_2) U900.121(VDD_10) U900.131(VDD_11) U900.143(PDR_ON) U900.144(VDD_3) ; port 3V3
GND: C900.1 C901.1 C902.1 C903.1 C906.2 C907.2 C908.2 C909.1 C910.1 C911.1 C912.1 C913.1 C914.1 C915.1 C916.1 C917.1 C918.1 C919.1 C920.1 C921.2 C922.1 C923.1 CON900.4(GND) CON900.6(GND) CON900.8(GND) CON900.10(GND) CON900.12(GND) CON900.14(GND) CON900.16(GND) CON900.18(GND) CON900.20(GND) OSC900.2(GND) OSC900.4(GND) R904.1 U900.16(VSS_5) U900.31(VSSA) U900.38(VSS_4) U900.51(VSS_6) U900.61(VSS_7) U900.83(VSS_8) U900.94(VSS_9) U900.107(VSS_2) U900.120(VSS_10) U900.130(VSS_11) ; port GND
ADC_CS: U900.3(PE4) ; port ADC_CS
ADC_DOUT: U900.4(PE5) ; port ADC_DOUT
ADC_SCLK: U900.1(PE2) ; port ADC_SCLK
BOOT0: R904.2 U900.138(BOOT0)
CAN0RX: U900.139(PB8) ; port CAN0RX
CAN0TX: U900.140(PB9) ; port CAN0TX
CAN1RX: U900.135(PB5) ; port CAN1RX
CAN1TX: U900.136(PB6) ; port CAN1TX
CRS_DV: U900.43(PA7) ; port CRS_DV
D0: U900.100(PA8)
D1: U900.41(PA5)
D2: U900.42(PA6)
D3: U900.81(PD12)
D4: U900.34(PA0-WKUP1)
D5: U900.96(PC6)
D6: U900.65(PE12)
D7: U900.66(PE13)
DAT0: U900.98(PC8)
DAT1: U900.99(PC9)
DAT2: U900.111(PC10)
DAT3: U900.112(PC11)
I2C2_SCL: U900.11(PF1) ; port I2C2_SCL
I2C2_SDA: U900.10(PF0) ; port I2C2_SDA
LED_B: U900.87(PG2) ; port LED_B
LED_G: U900.57(PG1) ; port LED_G
LED_R: U900.56(PG0) ; port LED_R
MDC: U900.27(PC1) ; port MDC
MDIO: U900.36(PA2) ; port MDIO
MUX0: U900.58(PE7)
MUX1: U900.59(PE8)
MUX2: U900.60(PE9)
MUX3: U900.63(PE10)
MUXEN: U900.64(PE11) ; port MUXEN
NRST: CON900.15(RESET) U900.25(NRST)
OSCIN: U900.35(PA1) ; port OSCIN
PC14-OSC32_IN: R902.2 U900.8(PC14-OSC32_IN)
PC15-OSC32_OUT: R903.2 U900.9(PC15-OSC32_OUT)
PH0-OSC_IN: R900.2 U900.23(PH0-OSC_IN)
PH1-OSC_OUT: R901.2 U900.24(PH1-OSC_OUT)
RXD0: U900.44(PC4) ; port RXD0
RXD1: U900.45(PC5) ; port RXD1
SD_CD: U900.28(PC2) ; port SD_CD
SD_CLK: U900.113(PC12) ; port SD_CLK
SD_CMD: U900.116(PD2) ; port SD_CMD
SD_WP: U900.29(PC3) ; port SD_WP
SPI5_MISO: U900.20(PF8) ; port SPI5_MISO
SPI5_MOSI: U900.21(PF9) ; port SPI5_MOSI
SPI5_SCK: U900.19(PF7) ; port SPI5_SCK
SWCLK: CON900.9(SWCLK) U900.109(PA14)
SWDIO: CON900.7(SWDIO) U900.105(PA13)
SWO: CON900.13(SWO) U900.133(PB3)
TX_EN: U900.70(PB11) ; port TX_EN
TXD0: U900.73(PB12) ; port TXD0
TXD1: U900.74(PB13) ; port TXD1
USART2_CK: U900.123(PD7) ; port USART2_CK
USART2_CTS: U900.117(PD3) ; port USART2_CTS
USART2_RTS: U900.118(PD4) ; port USART2_RTS
USART2_RX: U900.122(PD6) ; port USART2_RX
USART2_TX: U900.119(PD5) ; port USART2_TX
NetC900_2: C900.2 OSC900.1(OSC_IN) R900.1
NetC901_2: C901.2 OSC900.3(OSC_OUT) R901.1
NetC902_2: C902.2 OSC901.4(OSC_IN) R902.1
NetC903_2: C903.2 OSC901.1(OSC_OUT) R903.1
NetC906_1: C906.1 C907.1 L900.2 U900.32(VREF+) U900.33(VDDA)
NetC922_2: C922.2 U900.106(VCAP2)
NetC923_2: C923.2 U900.71(VCAP1)

Not connected (* = marked no-connect by the designer): CON900 3(NC) 5(NC) 11(NC) 17(NC) 19(NC); OSC901 2(NC) 3(NC); U900 2(PE3) 5(PE6) 7(PC13-WKUP2) 12(PF2) 13(PF3) 14(PF4) 15(PF5) 18(PF6) 22(PF10) 26(PC0) 37(PA3) 40(PA4) 46(PB0) 47(PB1) 48(PB2/BOOT1) 49(PF11) 50(PF12) 53(PF13) 54(PF14) 55(PF15) 67(PE14) 68(PE15) 69(PB10) 75(PB14) 76(PB15) 77(PD8) 78(PD9) 79(PD10) 80(PD11) 82(PD13) 85(PD14) 86(PD15) 88(PG3) 89(PG4) 90(PG5) 91(PG6) 92(PG7) 93(PG8) 97(PC7) 101(PA9) 102(PA10) 103(PA11) 104(PA12) 110(PA15) 114(PD0) 115(PD1) 124(PG9) 125(PG10) 126(PG11) 127(PG12) 128(PG13) 129(PG14) 132(PG15) 134(PB4) 137(PB7) 141(PE0) 142(PE1)

### Buses and harness runs
bus D[0..7] = port D[0..7]
bus DAT[0..3] = port DAT[0..3]
bus MUX[0..3] = port MUX[0..3]

### Library data of the parts
C900-C903 C907-C923 = Capacitor Ceramic: Ceramic Chip Capacitor
C906 = Capacitor Polarized: Polarized Capacitor (Surface Mount)
CON900 = JTAG/SWO-20PIN
L900 = Chip Ferrite Bead: Ferrite Bead; Part: BK1608HS601-TV
OSC900 = ABMM2-8.000MHZ-E2-T
OSC901 = MC-306 32.768K-E3: 32.7680kHz Oscillator
R900-R904 = Resistor

## Sheet SDCard.SchDoc: SD Card
size A; DocumentNumber: 7; SheetNumber: 7; SheetTotal: 9
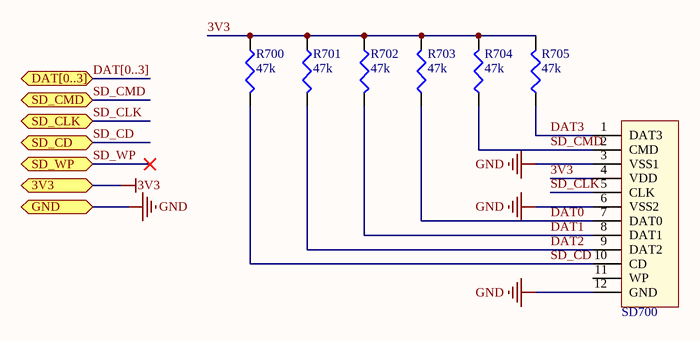
[diagram p7: SDCard.SchDoc]

### Parts
R700  value 47k  [SMD0603]  (hidden comment: Res)
R701  value 47k  [SMD0603]  (hidden comment: Res)
R702  value 47k  [SMD0603]  (hidden comment: Res)
R703  value 47k  [SMD0603]  (hidden comment: Res)
R704  value 47k  [SMD0603]  (hidden comment: Res)
R705  value 47k  [SMD0603]  (hidden comment: Res)
SD700  SD Card Slot  [SDCARD-AMP]  (value not drawn)

### Ports
3V3, DAT[0..3], GND, SD_CD, SD_CLK, SD_CMD, SD_WP

### Nets
3V3: R700.1 R701.1 R702.1 R703.2 R704.2 R705.2 SD700.4(VDD) ; port 3V3
GND: SD700.3(VSS1) SD700.6(VSS2) SD700.12(GND) ; port GND
DAT0: R703.1 SD700.7(DAT0)
DAT1: R702.2 SD700.8(DAT1)
DAT2: R701.2 SD700.9(DAT2)
DAT3: R705.1 SD700.1(DAT3)
SD_CD: R700.2 SD700.10(CD) ; port SD_CD
SD_CLK: SD700.5(CLK) ; port SD_CLK
SD_CMD: R704.1 SD700.2(CMD) ; port SD_CMD

Not connected (* = marked no-connect by the designer): SD700 11(WP)

### Buses and harness runs
bus DAT[0..3] = port DAT[0..3]

### Library data of the parts
R700-R705 = Resistor
SD700 = SD Card Slot: SD Card Connector (Amphenol); pin to pad: 12>GND

## Sheet Breakouts.SchDoc: Breakouts and Testpoints
size A; DocumentNumber: 8; SheetNumber: 8; SheetTotal: 9
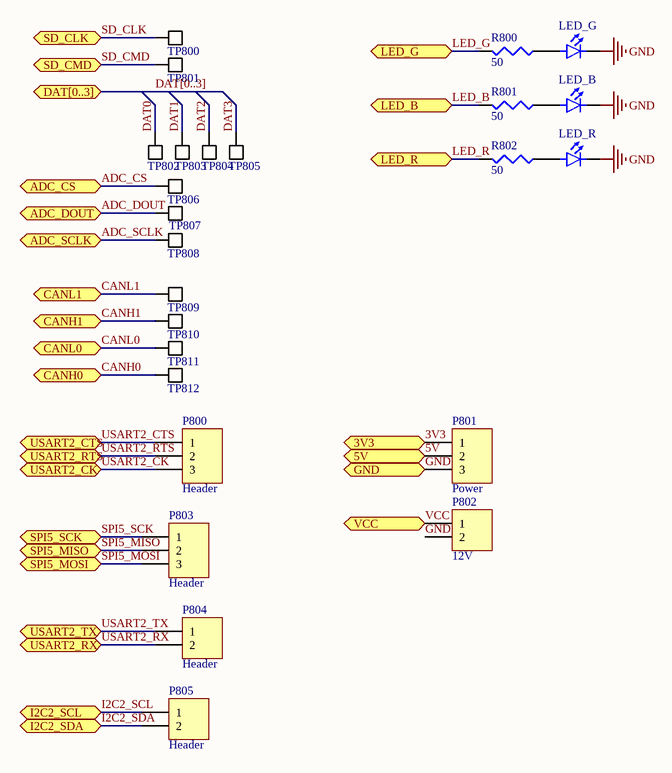
[diagram p8: Breakouts.SchDoc]

### Parts
LED_B  LED  [SMD0603 POLARIZED]  (value not drawn)
LED_G  LED  [SMD0603 POLARIZED]  (value not drawn)
LED_R  LED  [SMD0603 POLARIZED]  (value not drawn)
P800  Header  [HEADER 3X1]
P801  Power  [HEADER 3X1]
P802  12V  [Header 2x1]
P803  Header  [HEADER 3X1]
P804  Header  [Header 2x1]
P805  Header  [Header 2x1]
R800  value 50  [SMD0603]  (hidden comment: Res)
R801  value 50  [SMD0603]  (hidden comment: Res)
R802  value 50  [SMD0603]  (hidden comment: Res)
TP800  Test Point  [Test Point]  (value not drawn)
TP801  Test Point  [Test Point]  (value not drawn)
TP802  Test Point  [Test Point]  (value not drawn)
TP803  Test Point  [Test Point]  (value not drawn)
TP804  Test Point  [Test Point]  (value not drawn)
TP805  Test Point  [Test Point]  (value not drawn)
TP806  Test Point  [Test Point]  (value not drawn)
TP807  Test Point  [Test Point]  (value not drawn)
TP808  Test Point  [Test Point]  (value not drawn)
TP809  Test Point  [Test Point]  (value not drawn)
TP810  Test Point  [Test Point]  (value not drawn)
TP811  Test Point  [Test Point]  (value not drawn)
TP812  Test Point  [Test Point]  (value not drawn)

### Ports
3V3, 5V, ADC_CS, ADC_DOUT, ADC_SCLK, CANH0, CANH1, CANL0, CANL1, DAT[0..3], GND, I2C2_SCL, I2C2_SDA, LED_B, LED_G, LED_R, SD_CLK, SD_CMD, SPI5_MISO, SPI5_MOSI, SPI5_SCK, USART2_CK, USART2_CTS, USART2_RTS, USART2_RX, USART2_TX, VCC

### Nets
3V3: P801.1 ; port 3V3
5V: P801.2 ; port 5V
GND: LED_B.2(Cathode_(-)) LED_G.2(Cathode_(-)) LED_R.2(Cathode_(-)) P801.3 P802.2 ; port GND
VCC: P802.1 ; port VCC  [project net 12V]
ADC_CS: TP806.1 ; port ADC_CS
ADC_DOUT: TP807.1 ; port ADC_DOUT
ADC_SCLK: TP808.1 ; port ADC_SCLK
CANH0: TP812.1 ; port CANH0
CANH1: TP810.1 ; port CANH1
CANL0: TP811.1 ; port CANL0
CANL1: TP809.1 ; port CANL1
DAT0: TP802.1
DAT1: TP803.1
DAT2: TP804.1
DAT3: TP805.1
I2C2_SCL: P805.1 ; port I2C2_SCL
I2C2_SDA: P805.2 ; port I2C2_SDA
LED_B: R801.2 ; port LED_B
LED_G: R800.2 ; port LED_G
LED_R: R802.2 ; port LED_R
SD_CLK: TP800.1 ; port SD_CLK
SD_CMD: TP801.1 ; port SD_CMD
SPI5_MISO: P803.2 ; port SPI5_MISO
SPI5_MOSI: P803.3 ; port SPI5_MOSI
SPI5_SCK: P803.1 ; port SPI5_SCK
USART2_CK: P800.3 ; port USART2_CK
USART2_CTS: P800.1 ; port USART2_CTS
USART2_RTS: P800.2 ; port USART2_RTS
USART2_RX: P804.2 ; port USART2_RX
USART2_TX: P804.1 ; port USART2_TX
NetLED_B_1: LED_B.1(Anode_(+)) R801.1
NetLED_G_1: LED_G.1(Anode_(+)) R800.1
NetLED_R_1: LED_R.1(Anode_(+)) R802.1

### Buses and harness runs
bus DAT[0..3] = port DAT[0..3]

### Library data of the parts
P800 P801 P803 = Header 3x1: Header, 2-Pin
P802 P804 P805 = Header 2x1: Header, 2-Pin
R800-R802 = Resistor
TP800-TP812 = Test Point: Supplier 1: Digi-Key; Supplier Part Number 1: 5019KCT-ND

## Nets that join several sheets
3V3: PowerSupplies (C202.1 IC202.Vout), AnalogCapture (C317.1 C318.2 IC305.1 IC309.9), DigitalComm (26 pins), DigitalCapture (IC500.2), MCU (31 pins), SDCard (7 pins), Breakouts (P801.1)
5V: PowerSupplies (5 pins), AnalogCapture (11 pins), DigitalComm (C412.1 C413.1 IC401.3 IC402.3), DigitalCapture (R500.2), Breakouts (P801.2)
5VADC: PowerSupplies (C205.2 IC201.6), AnalogCapture (C313.1 C315.2 IC309.1)
12V: PowerSupplies (C201.1 C204.2 IC200.Vin IC201.2), Connectors (CON601.8 CON601.13), Breakouts (P802.1)
GND: PowerSupplies (9 pins), AnalogCapture (35 pins), DigitalComm (26 pins), DigitalCapture (C500.2 IC500.1), Connectors (16 pins), MCU (44 pins), SDCard (SD700.3 SD700.6 SD700.12), Breakouts (5 pins)
ADC_CS: AnalogCapture (R316.2), MCU (U900.3), Breakouts (TP806.1)
ADC_DOUT: AnalogCapture (R317.2), MCU (U900.4), Breakouts (TP807.1)
ADC_SCLK: AnalogCapture (R318.2), MCU (U900.1), Breakouts (TP808.1)
Ain0: AnalogCapture (IC300.5), Connectors (CON600.1 IC600.6)
Ain1: AnalogCapture (IC301.5), Connectors (CON600.2 IC600.4)
Ain2: AnalogCapture (IC301.3), Connectors (CON600.3 IC600.1)
Ain3: AnalogCapture (IC300.3), Connectors (CON600.4 IC600.3)
Ain4: AnalogCapture (IC302.5), Connectors (CON600.5 IC605.6)
Ain5: AnalogCapture (IC306.5), Connectors (CON600.6 IC605.4)
Ain6: AnalogCapture (IC306.3), Connectors (CON600.7 IC605.1)
Ain7: AnalogCapture (IC303.5), Connectors (CON600.8 IC601.6)
Ain8: AnalogCapture (IC304.5), Connectors (CON600.9 IC601.4)
Ain9: AnalogCapture (IC303.3), Connectors (CON600.10 IC601.3)
Ain10: AnalogCapture (IC304.3), Connectors (CON600.11 IC601.1)
Ain11: AnalogCapture (IC307.5), Connectors (CON600.12 IC604.6)
Ain12: AnalogCapture (IC302.3), Connectors (CON600.13 IC605.3)
Ain13: AnalogCapture (IC307.3), Connectors (CON600.14 IC602.1)
Ain14: AnalogCapture (IC308.3), Connectors (CON600.15 IC602.6)
Ain15: AnalogCapture (IC308.5), Connectors (CON600.16 IC603.1)
CAN0RX: DigitalComm (R415.2), MCU (U900.139)
CAN0TX: DigitalComm (R411.2), MCU (U900.140)
CAN1RX: DigitalComm (R416.2), MCU (U900.135)
CAN1TX: DigitalComm (R412.2), MCU (U900.136)
CANH0: DigitalComm (IC401.7 IC403.2 R413.1), Connectors (CON601.2), Breakouts (TP812.1)
CANH1: DigitalComm (IC402.7 IC404.2 R414.1), Connectors (CON601.5), Breakouts (TP810.1)
CANL0: DigitalComm (IC401.6 IC403.1 R413.2), Connectors (CON601.3), Breakouts (TP811.1)
CANL1: DigitalComm (IC402.6 IC404.1 R414.2), Connectors (CON601.6), Breakouts (TP809.1)
CRS_DV: DigitalComm (IC400.40 R403.1), MCU (U900.43)
D0: DigitalCapture (IC500.7), MCU (U900.100)
D1: DigitalCapture (IC500.9), MCU (U900.41)
D2: DigitalCapture (IC500.10), MCU (U900.42)
D3: DigitalCapture (IC500.3), MCU (U900.81)
D4: DigitalCapture (IC500.4), MCU (U900.34)
D5: DigitalCapture (IC500.5), MCU (U900.96)
D6: DigitalCapture (IC500.6), MCU (U900.65)
D7: DigitalCapture (IC500.8), MCU (U900.66)
DAT0: MCU (U900.98), SDCard (R703.1 SD700.7), Breakouts (TP802.1)
DAT1: MCU (U900.99), SDCard (R702.2 SD700.8), Breakouts (TP803.1)
DAT2: MCU (U900.111), SDCard (R701.2 SD700.9), Breakouts (TP804.1)
DAT3: MCU (U900.112), SDCard (R705.1 SD700.1), Breakouts (TP805.1)
Din0: DigitalCapture (IC500.14), Connectors (CON600.17 IC603.6)
Din1: DigitalCapture (IC500.12), Connectors (CON600.18 IC604.1)
Din2: DigitalCapture (IC500.11), Connectors (CON600.19 IC604.4)
Din3: DigitalCapture (IC500.18), Connectors (CON600.20 IC602.3)
Din4: DigitalCapture (IC500.17), Connectors (CON600.21 IC602.4)
Din5: DigitalCapture (IC500.16), Connectors (CON600.22 IC603.3)
Din6: DigitalCapture (IC500.15), Connectors (CON600.23 IC603.4)
Din7: DigitalCapture (IC500.13), Connectors (CON600.24 IC604.3)
I2C2_SCL: MCU (U900.11), Breakouts (P805.1)
I2C2_SDA: MCU (U900.10), Breakouts (P805.2)
LED_B: MCU (U900.87), Breakouts (R801.2)
LED_G: MCU (U900.57), Breakouts (R800.2)
LED_R: MCU (U900.56), Breakouts (R802.2)
MDC: DigitalComm (IC400.31), MCU (U900.27)
MDIO: DigitalComm (IC400.30), MCU (U900.36)
MUX0: AnalogCapture (IC305.17), MCU (U900.58)
MUX1: AnalogCapture (IC305.16), MCU (U900.59)
MUX2: AnalogCapture (IC305.15), MCU (U900.60)
MUX3: AnalogCapture (IC305.14), MCU (U900.63)
MUXEN: AnalogCapture (IC305.18), MCU (U900.64)
OSCIN: DigitalComm (IC400.34 OSC400.3), MCU (U900.35)
RXD0: DigitalComm (IC400.43), MCU (U900.44)
RXD1: DigitalComm (IC400.44), MCU (U900.45)
SD_CD: MCU (U900.28), SDCard (R700.2 SD700.10)
SD_CLK: MCU (U900.113), SDCard (SD700.5), Breakouts (TP800.1)
SD_CMD: MCU (U900.116), SDCard (R704.1 SD700.2), Breakouts (TP801.1)
SPI5_MISO: MCU (U900.20), Breakouts (P803.2)
SPI5_MOSI: MCU (U900.21), Breakouts (P803.3)
SPI5_SCK: MCU (U900.19), Breakouts (P803.1)
TX_EN: DigitalComm (IC400.2), MCU (U900.70)
TXD0: DigitalComm (IC400.3), MCU (U900.73)
TXD1: DigitalComm (IC400.4), MCU (U900.74)
USART2_CK: MCU (U900.123), Breakouts (P800.3)
USART2_CTS: MCU (U900.117), Breakouts (P800.1)
USART2_RTS: MCU (U900.118), Breakouts (P800.2)
USART2_RX: MCU (U900.122), Breakouts (P804.2)
USART2_TX: MCU (U900.119), Breakouts (P804.1)